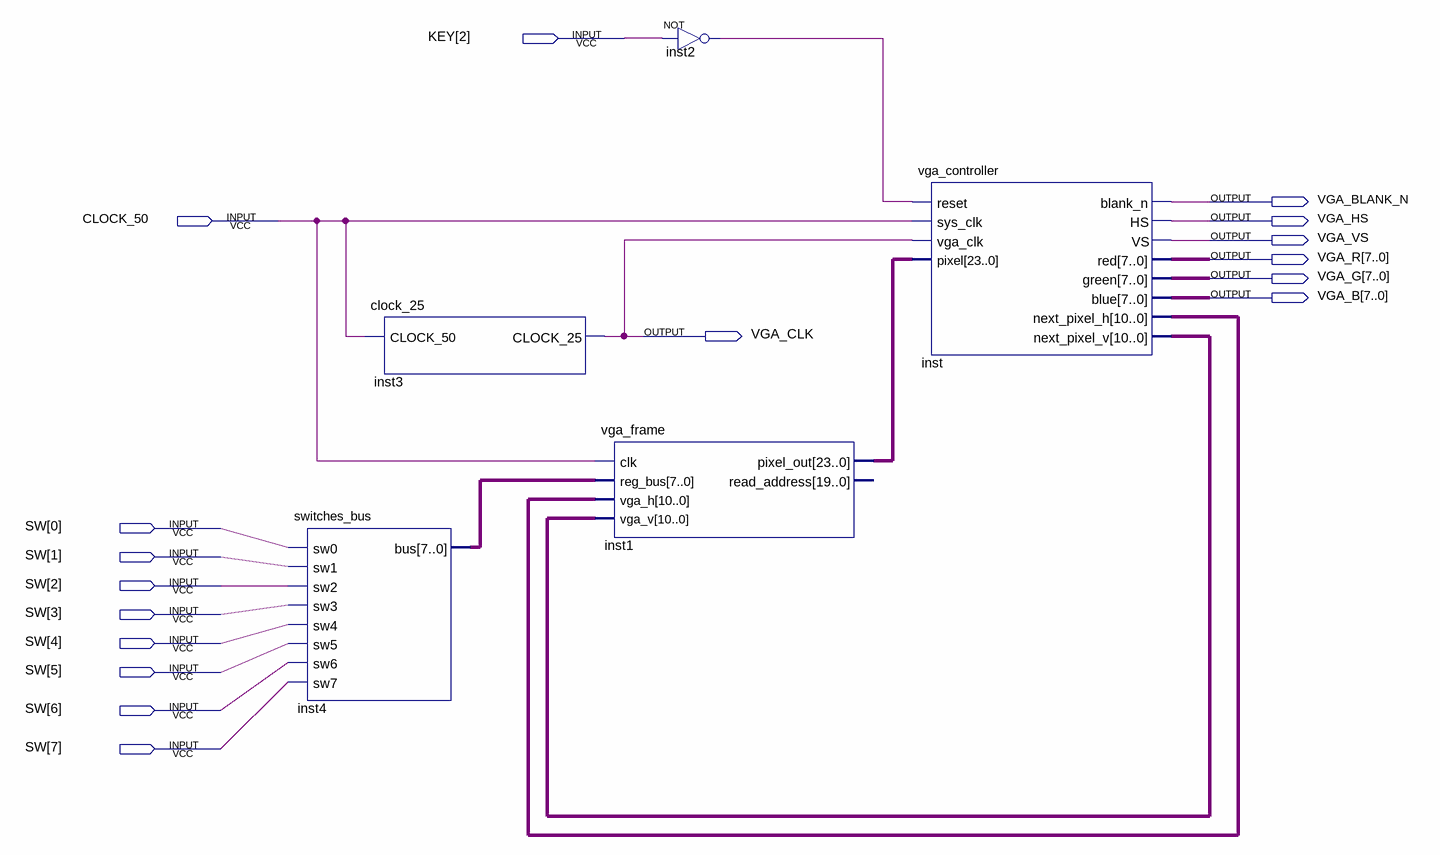
[diagram p0: schematic sheet]
// Quartus schematic project.bdf as structural Verilog: 5 symbols, 17 pins
module project (
  input  [2:2] KEY,
  input  CLOCK_50,
  input  [7:0] SW,
  output VGA_BLANK_N,
  output VGA_HS,
  output VGA_VS,
  output [7:0] VGA_R,
  output [7:0] VGA_G,
  output [7:0] VGA_B,
  output VGA_CLK
);

  wire inst2_out;
  wire [7:0] inst4_bus;
  wire [10:0] inst_next_pixel_h, inst_next_pixel_v;
  wire [23:0] inst1_pixel_out;

  switches_bus inst4 (
    .sw0(SW[0]), .sw1(SW[1]), .sw2(SW[2]), .sw3(SW[3]), .sw4(SW[4]), .sw5(SW[5]), .sw6(SW[6]), .sw7(SW[7]),
    .bus(inst4_bus));
  clock_25 inst3 (.CLOCK_50(CLOCK_50), .CLOCK_25(VGA_CLK));
  vga_frame inst1 (
    .clk(CLOCK_50), .reg_bus(inst4_bus), .vga_h(inst_next_pixel_h), .vga_v(inst_next_pixel_v),
    .pixel_out(inst1_pixel_out));  // open: read_address
  not inst2 (inst2_out, KEY[2]);
  vga_controller inst (
    .reset(inst2_out), .sys_clk(CLOCK_50), .vga_clk(VGA_CLK), .pixel(inst1_pixel_out), .blank_n(VGA_BLANK_N),
    .HS(VGA_HS), .VS(VGA_VS), .red(VGA_R), .green(VGA_G), .blue(VGA_B), .next_pixel_h(inst_next_pixel_h),
    .next_pixel_v(inst_next_pixel_v));
endmodule
